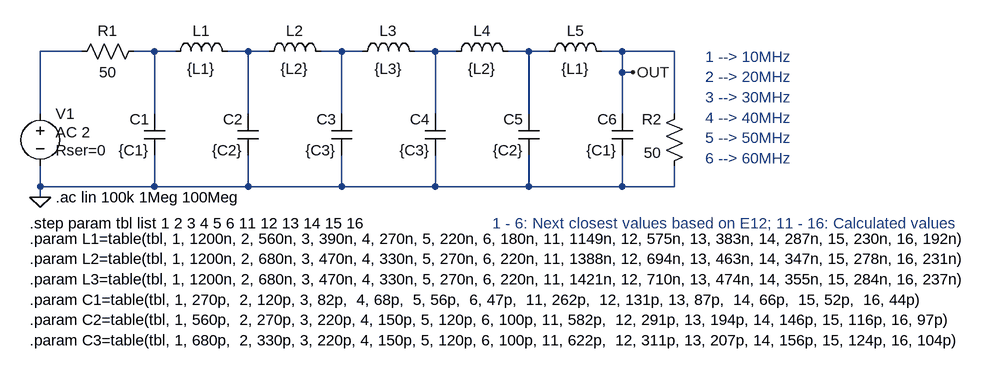
[diagram p0: schematic LowPass.asc]
LowPass.asc, the LTspice schematic file:
Version 4
SHEET 1 880 680
WIRE -2304 -320 -2368 -320
WIRE -2192 -320 -2224 -320
WIRE -2160 -320 -2192 -320
WIRE -2048 -320 -2080 -320
WIRE -2016 -320 -2048 -320
WIRE -1904 -320 -1936 -320
WIRE -1872 -320 -1904 -320
WIRE -1760 -320 -1792 -320
WIRE -1728 -320 -1760 -320
WIRE -1616 -320 -1648 -320
WIRE -1584 -320 -1616 -320
WIRE -1472 -320 -1504 -320
WIRE -1392 -320 -1472 -320
WIRE -1472 -288 -1472 -320
WIRE -1456 -288 -1472 -288
WIRE -2368 -224 -2368 -320
WIRE -2192 -224 -2192 -320
WIRE -2048 -224 -2048 -320
WIRE -1904 -224 -1904 -320
WIRE -1760 -224 -1760 -320
WIRE -1616 -224 -1616 -320
WIRE -1472 -224 -1472 -288
WIRE -1392 -224 -1392 -320
WIRE -2368 -112 -2368 -144
WIRE -2192 -112 -2192 -160
WIRE -2192 -112 -2368 -112
WIRE -2048 -112 -2048 -160
WIRE -2048 -112 -2192 -112
WIRE -1904 -112 -1904 -160
WIRE -1904 -112 -2048 -112
WIRE -1760 -112 -1760 -160
WIRE -1760 -112 -1904 -112
WIRE -1616 -112 -1616 -160
WIRE -1616 -112 -1760 -112
WIRE -1472 -112 -1472 -160
WIRE -1472 -112 -1616 -112
WIRE -1392 -112 -1392 -144
WIRE -1392 -112 -1472 -112
WIRE -2368 -96 -2368 -112
FLAG -2368 -96 0
FLAG -1456 -288 OUT
SYMBOL ind -2176 -304 R270
WINDOW 0 32 56 VTop 2
WINDOW 3 5 56 VBottom 2
SYMATTR InstName L1
SYMATTR Value {L1}
SYMBOL voltage -2368 -240 R0
WINDOW 3 24 44 Left 2
WINDOW 123 24 44 Left 2
WINDOW 39 24 72 Left 2
SYMATTR Value ""
SYMATTR Value2 AC 2
SYMATTR SpiceLine Rser=0
SYMATTR InstName V1
SYMBOL res -2320 -304 R270
WINDOW 0 32 56 VTop 2
WINDOW 3 0 56 VBottom 2
SYMATTR InstName R1
SYMATTR Value 50
SYMBOL cap -2176 -160 R180
WINDOW 0 24 56 Left 2
WINDOW 3 24 8 Left 2
SYMATTR InstName C1
SYMATTR Value {C1}
SYMBOL ind -1744 -304 R270
WINDOW 0 32 56 VTop 2
WINDOW 3 5 56 VBottom 2
SYMATTR InstName L4
SYMATTR Value {L2}
SYMBOL cap -2032 -160 R180
WINDOW 0 24 56 Left 2
WINDOW 3 24 8 Left 2
SYMATTR InstName C2
SYMATTR Value {C2}
SYMBOL ind -1600 -304 R270
WINDOW 0 32 56 VTop 2
WINDOW 3 5 56 VBottom 2
SYMATTR InstName L5
SYMATTR Value {L1}
SYMBOL cap -1600 -160 R180
WINDOW 0 24 56 Left 2
WINDOW 3 24 8 Left 2
SYMATTR InstName C5
SYMATTR Value {C2}
SYMBOL cap -1456 -160 R180
WINDOW 0 24 56 Left 2
WINDOW 3 24 8 Left 2
SYMATTR InstName C6
SYMATTR Value {C1}
SYMBOL res -1376 -240 M0
WINDOW 0 35 24 Left 2
SYMATTR InstName R2
SYMATTR Value 50
SYMBOL ind -2032 -304 R270
WINDOW 0 32 56 VTop 2
WINDOW 3 5 56 VBottom 2
SYMATTR InstName L2
SYMATTR Value {L2}
SYMBOL cap -1888 -160 R180
WINDOW 0 24 56 Left 2
WINDOW 3 24 8 Left 2
SYMATTR InstName C3
SYMATTR Value {C3}
SYMBOL ind -1888 -304 R270
WINDOW 0 32 56 VTop 2
WINDOW 3 5 56 VBottom 2
SYMATTR InstName L3
SYMATTR Value {L3}
SYMBOL cap -1744 -160 R180
WINDOW 0 24 56 Left 2
WINDOW 3 24 8 Left 2
SYMATTR InstName C4
SYMATTR Value {C3}
TEXT -2344 -96 Left 2 !.ac lin 100k 1Meg 100Meg
TEXT -2384 -32 Left 2 !.param L1=table(tbl, 1, 1200n, 2, 560n, 3, 390n, 4, 270n, 5, 220n, 6, 180n, 11, 1149n, 12, 575n, 13, 383n, 14, 287n, 15, 230n, 16, 192n)\n.param L2=table(tbl, 1, 1200n, 2, 680n, 3, 470n, 4, 330n, 5, 270n, 6, 220n, 11, 1388n, 12, 694n, 13, 463n, 14, 347n, 15, 278n, 16, 231n)\n.param L3=table(tbl, 1, 1200n, 2, 680n, 3, 470n, 4, 330n, 5, 270n, 6, 220n, 11, 1421n, 12, 710n, 13, 474n, 14, 355n, 15, 284n, 16, 237n)\n.param C1=table(tbl, 1, 270p,  2, 120p, 3, 82p,  4, 68p,  5, 56p,  6, 47p,  11, 262p,  12, 131p, 13, 87p,  14, 66p,  15, 52p,  16, 44p)\n.param C2=table(tbl, 1, 560p,  2, 270p, 3, 220p, 4, 150p, 5, 120p, 6, 100p, 11, 582p,  12, 291p, 13, 194p, 14, 146p, 15, 116p, 16, 97p)\n.param C3=table(tbl, 1, 680p,  2, 330p, 3, 220p, 4, 150p, 5, 120p, 6, 100p, 11, 622p,  12, 311p, 13, 207p, 14, 156p, 15, 124p, 16, 104p)
TEXT -1344 -312 Left 2 ;1 --> 10MHz\n2 --> 20MHz\n3 --> 30MHz\n4 --> 40MHz\n5 --> 50MHz\n6 --> 60MHz
TEXT -1672 -56 Left 2 ;1 - 6: Next closest values based on E12; 11 - 16: Calculated values
TEXT -2384 -56 Left 2 !.step param tbl list 1 2 3 4 5 6 11 12 13 14 15 16

The netlist it stands for:
* LowPass.asc
L1 N002 N003 {L1}
V1 N001 0 AC 2 Rser=0
R1 N001 N002 50
C1 0 N002 {C1}
L4 N005 N006 {L2}
C2 0 N003 {C2}
L5 N006 OUT {L1}
C5 0 N006 {C2}
C6 0 OUT {C1}
R2 OUT 0 50
L2 N003 N004 {L2}
C3 0 N004 {C3}
L3 N004 N005 {L3}
C4 0 N005 {C3}
.ac lin 100k 1Meg 100Meg
.param L1=table(tbl, 1, 1200n, 2, 560n, 3, 390n, 4, 270n, 5, 220n, 6, 180n, 11, 1149n, 12, 575n, 13, 383n, 14, 287n, 15, 230n, 16, 192n)
.param L2=table(tbl, 1, 1200n, 2, 680n, 3, 470n, 4, 330n, 5, 270n, 6, 220n, 11, 1388n, 12, 694n, 13, 463n, 14, 347n, 15, 278n, 16, 231n)
.param L3=table(tbl, 1, 1200n, 2, 680n, 3, 470n, 4, 330n, 5, 270n, 6, 220n, 11, 1421n, 12, 710n, 13, 474n, 14, 355n, 15, 284n, 16, 237n)
.param C1=table(tbl, 1, 270p,  2, 120p, 3, 82p,  4, 68p,  5, 56p,  6, 47p,  11, 262p,  12, 131p, 13, 87p,  14, 66p,  15, 52p,  16, 44p)
.param C2=table(tbl, 1, 560p,  2, 270p, 3, 220p, 4, 150p, 5, 120p, 6, 100p, 11, 582p,  12, 291p, 13, 194p, 14, 146p, 15, 116p, 16, 97p)
.param C3=table(tbl, 1, 680p,  2, 330p, 3, 220p, 4, 150p, 5, 120p, 6, 100p, 11, 622p,  12, 311p, 13, 207p, 14, 156p, 15, 124p, 16, 104p)
* 1 --> 10MHz
* 2 --> 20MHz
* 3 --> 30MHz
* 4 --> 40MHz
* 5 --> 50MHz
* 6 --> 60MHz
* 1 - 6: Next closest values based on E12; 11 - 16: Calculated values
.step param tbl list 1 2 3 4 5 6 11 12 13 14 15 16
.backanno
.end